# Altium schematic sheet Processor.SchDoc
size A
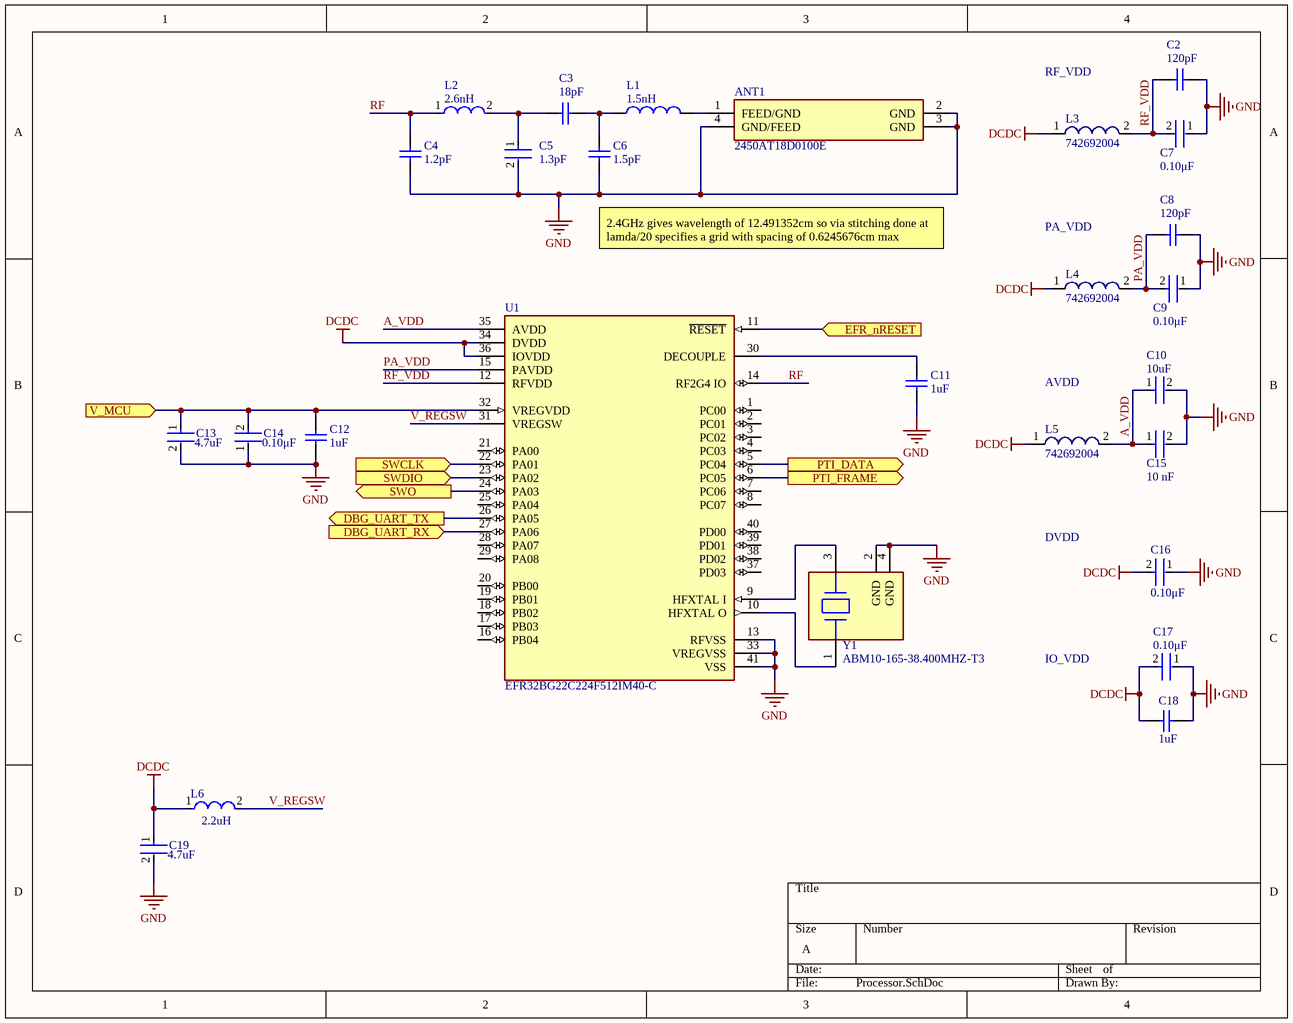
[diagram p0: Processor.SchDoc]

## Parts
ANT1  2450AT18D0100E  [FP-2450AT18D0100E-MFG]
C2  Capacitance: 120pF  [CAPC1608X87X35LL15T15]  (hidden comment: C0603C121J5GACAUTO)
C3  Capacitance: 18pF  [CAPC1006X50X20NL10T10]  (hidden comment: 0402ZK180GBSTR)
C4  Capacitance: 1.2pF  [CAPC1006X50X20LL10T10]  (hidden comment: 04023J1R2BBSTR)
C5  Capacitance: 1.3pF  [FP-GJM155-0_05-MFG]  (hidden comment: GJM1555C1H1R3BB01D)
C6  Capacitance: 1.5pF  [CAPC1006X50X20ML10T10]  (hidden comment: 04023J1R5PBSTR)
C7  Capacitance: 0.10μF  [FP-GRM15-MFG]  (hidden comment: GRM155R71C104KA88D)
C8  Capacitance: 120pF  [CAPC1608X87X35LL15T15]  (hidden comment: C0603C121J5GACAUTO)
C9  Capacitance: 0.10μF  [FP-GRM15-MFG]  (hidden comment: GRM155R71C104KA88D)
C10  Capacitance: 10uF  [FP-GRM188-0_1-e0_2_0_55-IPC_A]  (hidden comment: GRM188R60J106ME47D)
C11  Capacitance: 1uF  [CAPC1608X90X35LL15T15]  (hidden comment: C0603C105K9PACTU)
C12  Capacitance: 1uF  [CAPC1608X90X35LL15T15]  (hidden comment: C0603C105K9PACTU)
C13  Capacitance: 4.7uF  [FP-CL10-IPC_C]  (hidden comment: CL10B475KQ8NQNC)
C14  Capacitance: 0.10μF  [FP-GRM15-MFG]  (hidden comment: GRM155R71C104KA88D)
C15  Capacitance: 10 nF  [FP-CC0603-DA-MFG]  (hidden comment: CC0603KRX7R9BB103)
C16  Capacitance: 0.10μF  [FP-GRM15-MFG]  (hidden comment: GRM155R71C104KA88D)
C17  Capacitance: 0.10μF  [FP-GRM15-MFG]  (hidden comment: GRM155R71C104KA88D)
C18  Capacitance: 1uF  [CAPC1608X90X35LL15T15]  (hidden comment: C0603C105K9PACTU)
C19  Capacitance: 4.7uF  [FP-CL10-IPC_C]  (hidden comment: CL10B475KQ8NQNC)
L1  Inductance: 1.5nH  [WE-TCI_0402]  (hidden comment: 744901015)
L2  Inductance: 2.6nH  [FP-LQW15AN_80-MFG]  (hidden comment: LQW15AN2N6G8ZD)
L3  742692004  [WE-TMSB 0201]
L4  742692004  [WE-TMSB 0201]
L5  742692004  [WE-TMSB 0201]
L6  Inductance: 2.2uH  [FP-LQM18PZ_FH-MFG]  (hidden comment: LQM18PZ2R2MFHD)
U1  EFR32BG22C224F512IM40-C  [FP-EFR32BG22C224F512IM40-IPC_C]
Y1  ABM10-165-38.400MHZ-T3  [FP-ABM10-165-MFG]

## Ports
DBG_UART_RX (in), DBG_UART_TX (out), EFR_nRESET (in), PTI_DATA (out), PTI_FRAME (out), SWCLK (in), SWDIO (in), SWO (out), V_MCU (in)

## Nets
DCDC: C16.2 C17.2 C18.2 C19.1 L3.1 L4.1 L5.1 L6.1 U1.34(DVDD) U1.36(IOVDD)
GND: ANT1.2(GND) ANT1.3(GND) ANT1.4(GND/FEED) C2.2 C4.1 C5.2 C6.1 C7.1 C8.2 C9.1 C10.2 C11.1 C12.1 C13.2 C14.1 C15.2 C16.1 C17.1 C18.1 C19.2 U1.13(RFVSS) U1.33(VREGVSS) U1.41(VSS) Y1.2(GND) Y1.4(GND)
A_VDD: C10.1 C15.1 L5.2 U1.35(AVDD)
DBG_UART_RX: U1.27(PA06) ; port DBG_UART_RX
DBG_UART_TX: U1.26(PA05) ; port DBG_UART_TX
EFR_nRESET: U1.11(~{RESET}) ; port EFR_nRESET
PA_VDD: C8.1 C9.2 L4.2 U1.15(PAVDD)
PTI_DATA: U1.5(PC04) ; port PTI_DATA
PTI_FRAME: U1.6(PC05) ; port PTI_FRAME
RF: C4.2 L2.1 U1.14(RF2G4_IO)
RF_VDD: C2.1 C7.2 L3.2 U1.12(RFVDD)
SWCLK: U1.22(PA01) ; port SWCLK
SWDIO: U1.23(PA02) ; port SWDIO
SWO: U1.24(PA03) ; port SWO
V_MCU: C12.2 C13.1 C14.2 U1.32(VREGVDD) ; port V_MCU
V_REGSW: L6.2 U1.31(VREGSW)
NetANT1_1: ANT1.1(FEED/GND) L1.2
NetC3_1: C3.1 C5.1 L2.2
NetC3_2: C3.2 C6.2 L1.1
NetC11_2: C11.2 U1.30(DECOUPLE)
NetU1_9: U1.9(HFXTAL_I) Y1.3(2_Crystal)
NetU1_10: U1.10(HFXTAL_O) Y1.1(1_Crystal)

Not connected (* = marked no-connect by the designer): U1 1(PC00) 2(PC01) 3(PC02) 4(PC03) 7(PC06) 8(PC07) 16(PB04) 17(PB03) 18(PB02) 19(PB01) 20(PB00) 21(PA00) 25(PA04) 28(PA07) 29(PA08) 37(PD03) 38(PD02) 39(PD01) 40(PD00)

## Notes on the sheet
- RF_VDD
- PA_VDD
- (near C6) 2.4GHz gives wavelength of 12.491352cm so via stitching done at lamda/20 specifies a grid with spacing of 0.6245676cm max
- AVDD
- DVDD
- IO_VDD

## Library data of the parts
ANT1 = CMP-2000-05543-2: RF ANT 2.4GHZ CHIP SOLDER SMD; Gain: -1dB; Bandwidth: 100MHz; Frequency: 2.45GHz; Power Rating: 2W; Impedance: 50R; Number of Bands: 1; Return Loss: -10dB; Case/Package: SMD/SMT; Width: 1.6mm; RoHS Compliant: Yes; Package Quantity: 3000; Height: 0.047inch; Series: -; Max Power Dissipation: 2W; Mount: Surface Mount; Termination: Solder; Radiation Hardening: No; Packaging: Tape and Reel; Length: 3.2mm
C2 C8 = CMP-2006-03534-1: Manufacturer: Kemet; Part Number: C0603C121J5GACAUTO
C3 = CMP-2008-04842-1: Manufacturer: AVX Interconnect / Elco; Part Number: 0402ZK180GBSTR
C4 = CMP-2008-04752-1: Manufacturer: AVX Interconnect / Elco; Part Number: 04023J1R2BBSTR
C5 = CMP-2008-03816-2: Multi-Layer Ceramic Capacitor 1.3pF C0G  ±0.1pF 0402 Paper T/R; Voltage Rating: 50V; Mount: Surface Mount; Max Operating Temperature: 125°C; Min Operating Temperature: -55°C; Dielectric: C0G; Number of Pins: 2; Construction: Flat; Series: GJM; Length: 1mm; Width: 0.02inch; Height: 0.5mm; Voltage Rating (DC): 50V; Termination: SMD/SMT; REACH SVHC: No SVHC; Case Code (Imperial): 0402; Package Quantity: 1; Case/Package: 0402; Packaging: Tape and Reel; Lead Pitch: 0.3mm; Thickness: 0.022inch; Radiation Hardening: No; Lead Free: Lead Free; Depth: 0.5mm; Case Code (Metric): 1005
C6 = CMP-2008-04763-1: Manufacturer: AVX Interconnect / Elco; Part Number: 04023J1R5PBSTR
C7 C9 C14 C16 C17 = CMP-2100-03641-2: CAP CER 0.1UF 16V X7R 0402; Manufacturer: Murata; Standoff Height: 0mm; Tolerance: 10%; Voltage Rating: 16Vdc; Material: Ceramic; Value: 0.10μF; RoHS: TRUE; Manufacturer Part Number: GRM155R71C104KA88D; Temperature Characteristic: X7R; Octopart: https://octopart.com/grm155r71c104ka88d-murata-196880; Digikey Description: CAP CER 0.1UF 16V X7R 0402; Device Class L3: Ceramic Capacitors; Height: 0.55mm; ComponentLink2Description: Datasheet; Temperature Range Low: -55°C; Ipc Land Pattern Name: CAPC10050X219; ComponentLink2URL: https://search.murata.co.jp/Ceramy/image/img/A01X/G101/ENG/GRM155R71H471KA01-01A.pdf; Device Class L1: Passive Components; Lead Free: yes; Category: Cap; Package: GRM15; Temperature: -55°C to +125°C; Device Class L2: Capacitors; Temperature Range High: +125°C; Mouser Description: 0402 0.1 uF 16V ±10 % Tolerance X7R SMT Multilayer Ceramic Capacitor
C10 = CMP-2006-02792-2: Chip Multilayer Ceramic Capacitors for General Purpose, 0603, 10uF, X5R, 15%, 20%, 6.3V; Packaging: Tape and Reel; Voltage Rating (DC): 6.3V; Width: 0.031inch; Termination: SMD/SMT; Dielectric: X5R; Package Quantity: 4000; Voltage Rating: 6.3V; Case/Package: 0603; Min Operating Temperature: -55°C; Voltage: 6.3V; Length: 1.6mm; Thickness: 0.035inch; Lead Free: Lead Free; Depth: 0.8mm; Case Code (Imperial): 0603; Max Operating Temperature: 85°C; Material: Ceramic; Height: 0.8mm; Tolerance: 20%; Mount: Surface Mount; REACH SVHC: No SVHC; Radiation Hardening: No; Case Code (Metric): 1608
C11 C12 C18 = CMP-2006-02241-1: Manufacturer: Kemet; Part Number: C0603C105K9PACTU
C13 C19 = CMP-2000-06096-2: CAP CER 4.7UF 6.3V X7R 0603; Manufacturer: Samsung; Tolerance: 10%; Material: Ceramic; Temperature Coefficient: 15%; Device Class L3: Ceramic Capacitors; Temperature Characteristic: X7R; Automotive: No; Package: CL10; Device Class L2: Capacitors; Octopart: https://octopart.com/cl10b475kq8nqnc-samsung-24957976; ComponentLink2Description: Datasheet; Temperature Range High: +125°C; Lead Free: Yes; Height: 0.95mm; Temperature: -55°C to +125°C; Ipc Land Pattern Name: CAPC16080X80; Temperature Range Low: -55°C; Digikey Description: CAP CER 4.7UF 6.3V X7R 0603; Mouser Description: C Series 0402 4.7 uF 6.3 V ±20 % Tolerance X5R SMT Multilayer Ceramic Capacitor; Category: Cap; ComponentLink2URL: http://www.samsungsem.com/kr/support/product-search/mlcc/__icsFiles/afieldfile/2018/07/24/CL10B475KQ8NQNC.pdf; Value: 4.7uF; Voltage Rating: 6.3V; Manufacturer Part Number: CL10B475KQ8NQNC; Device Class L1: Passive Components; RoHS: TRUE
C15 = CMP-2100-03600-2: CAP CER 10000PF 50V X7R 0603; Manufacturer: YAGEO; Tolerance: 0.1; Material: Ceramic; Temperature Coefficient: 15%; Value: 10 nF; Mouser Description: Multilayer Ceramic Capacitor, CC Series, 0.01 - F, - 10%, X7R, 50 V, 0603 [1608 Metric]; Digikey Description: CAP CER 10000PF 50V X7R 0603; Height: 0.9mm; Category: Cap; Temperature Characteristic: X7R; Footprint Url: http://www.yageo.com/exep/pages/download/literatures/UPY-C_GEN_24.pdf; Lead Free: Yes; Voltage Rating: 50 V; Manufacturer Part Number: CC0603KRX7R9BB103; Temperature: -55°C to +125°C; Device Class L3: Ceramic Capacitors; ComponentLink2Description: Datasheet; Voltage: 50 V; Package: CC0603-DA; Octopart: https://octopart.com/cc0603krx7r9bb103-yageo-192938; Automotive: No; Temperature Range High: +125°C; Temperature Range Low: -55°C; RoHS: TRUE; Device Class L1: Passive Components; ComponentLink2URL: http://www.yageo.com/documents/recent/UPY-GPHC_X7R_6.3V-to-50V_18.pdf; Device Class L2: Capacitors
L1 = CMP-03913-14415873-1: 744901015 Fixed Ind 1.5NH 700MA 200MOHM Sm; DC Resistance (DCR): 140mΩ; Core Material: Alumina; Q Factor: 13; Test Frequency: 500MHz; Shielding: Unshielded; Self Resonant Frequency: 10GHz; Packaging: Digi-Reel®; Max Operating Temperature: 125°C; Height: 320µm; Weight: 652.039032µg; Case Code (Metric): 1005; Mount: Surface Mount; Current Rating: 700mA; Composition: Thin Film; Width: 500µm; Case Code (Imperial): 0402; Height - Seated (Max): 406.4µm; RoHS: Compliant; NexarPartId: 14415873; Number of Pins: 2; Case/Package: 0402; REACH SVHC: Unknown; Termination: SMD/SMT; Length: 1mm; Max DC Current: 700mA; Min Operating Temperature: -40°C
L2 = CMP-06042-008265-1: Wire Wound RF Inductor for Automotive 2.6nH ±2% 1950mA 0.035Ω 0402 (1005)
L3-L5 = CMP-1490-00003-1: Tiny Multilayer Suppression  Bead  WE-TMSB, Z= 240 Ohm; Manufacturer: Wuerth Elektronik; Impedance: 240 Ohm; ComponentLink2Description: Datasheet; ComponentLink1URL: http://www.we-online.com; ComponentLink1Description: Manufacturer URL; ComponentLink2URL: http://www.we-online.de/katalog/media/pdf/742692004.pdf; PackageReference: WE-TMSB 0201; PartNumber: 742692004
L6 = CMP-06042-017061-1: FIXED IND 2.2UH 700MA 470MOHM SM; Tolerance: 20%; Self Resonant Frequency: 80MHz; Saturation Current: 300mA; DC Resistance (DCR): 470mR; Shielding: Shielded; Test Frequency: 1MHz; Core Material: Ferrite; Ratings: AEC-Q200; Current Rating: 700mA; Mount: Surface Mount; Case Code (Metric): 2520; Packaging: Cut Tape; RoHS Compliant: Yes; Resistor Type: Thin Film; Case/Package: 0603; Max Operating Temperature: 125°C; Case Code (Imperial): 1008; Min Operating Temperature: -55°C
U1 = CMP-08140-000035-1: BLUE GECKO, QFN40, SECURE BOOT W; RoHS Compliant: Yes
Y1 = CMP-27762-010013-1: CRYSTAL 38.4000MHZ 10PF SMD; ESR (Equivalent Series Resistance): 40R; Frequency Stability: 20ppm; Frequency: 38.4MHz; Min Operating Temperature: -30°C; Width: 0.079inch; Load Capacitance: 10pF; Packaging: Tape and Reel; Length: 0.098inch; Height: 0.02inch; Case/Package: SMD/SMT; RoHS Compliant: Yes; Mount: Surface Mount; Max Operating Temperature: 85°C